# Altium schematic sheet bldc_motor_driver.SchDoc
size OrCAD C; PageSetup: Record=PageOptions|CenterHorizontal=True|CenterVertical=True|PrintScale=0.96|XCorrection=1.00|YCorrection=1.00|PrintKind=2|BorderSize=5000000|LeftOffset=0|BottomOffset=0|Orientation=2|PaperLength=4318|PaperWidth=2794|Scale=100|PaperSource=15|PrintQuality=600|MediaType=1|DitherType=10|PaperKind=11x17|PrintScaleMode=1
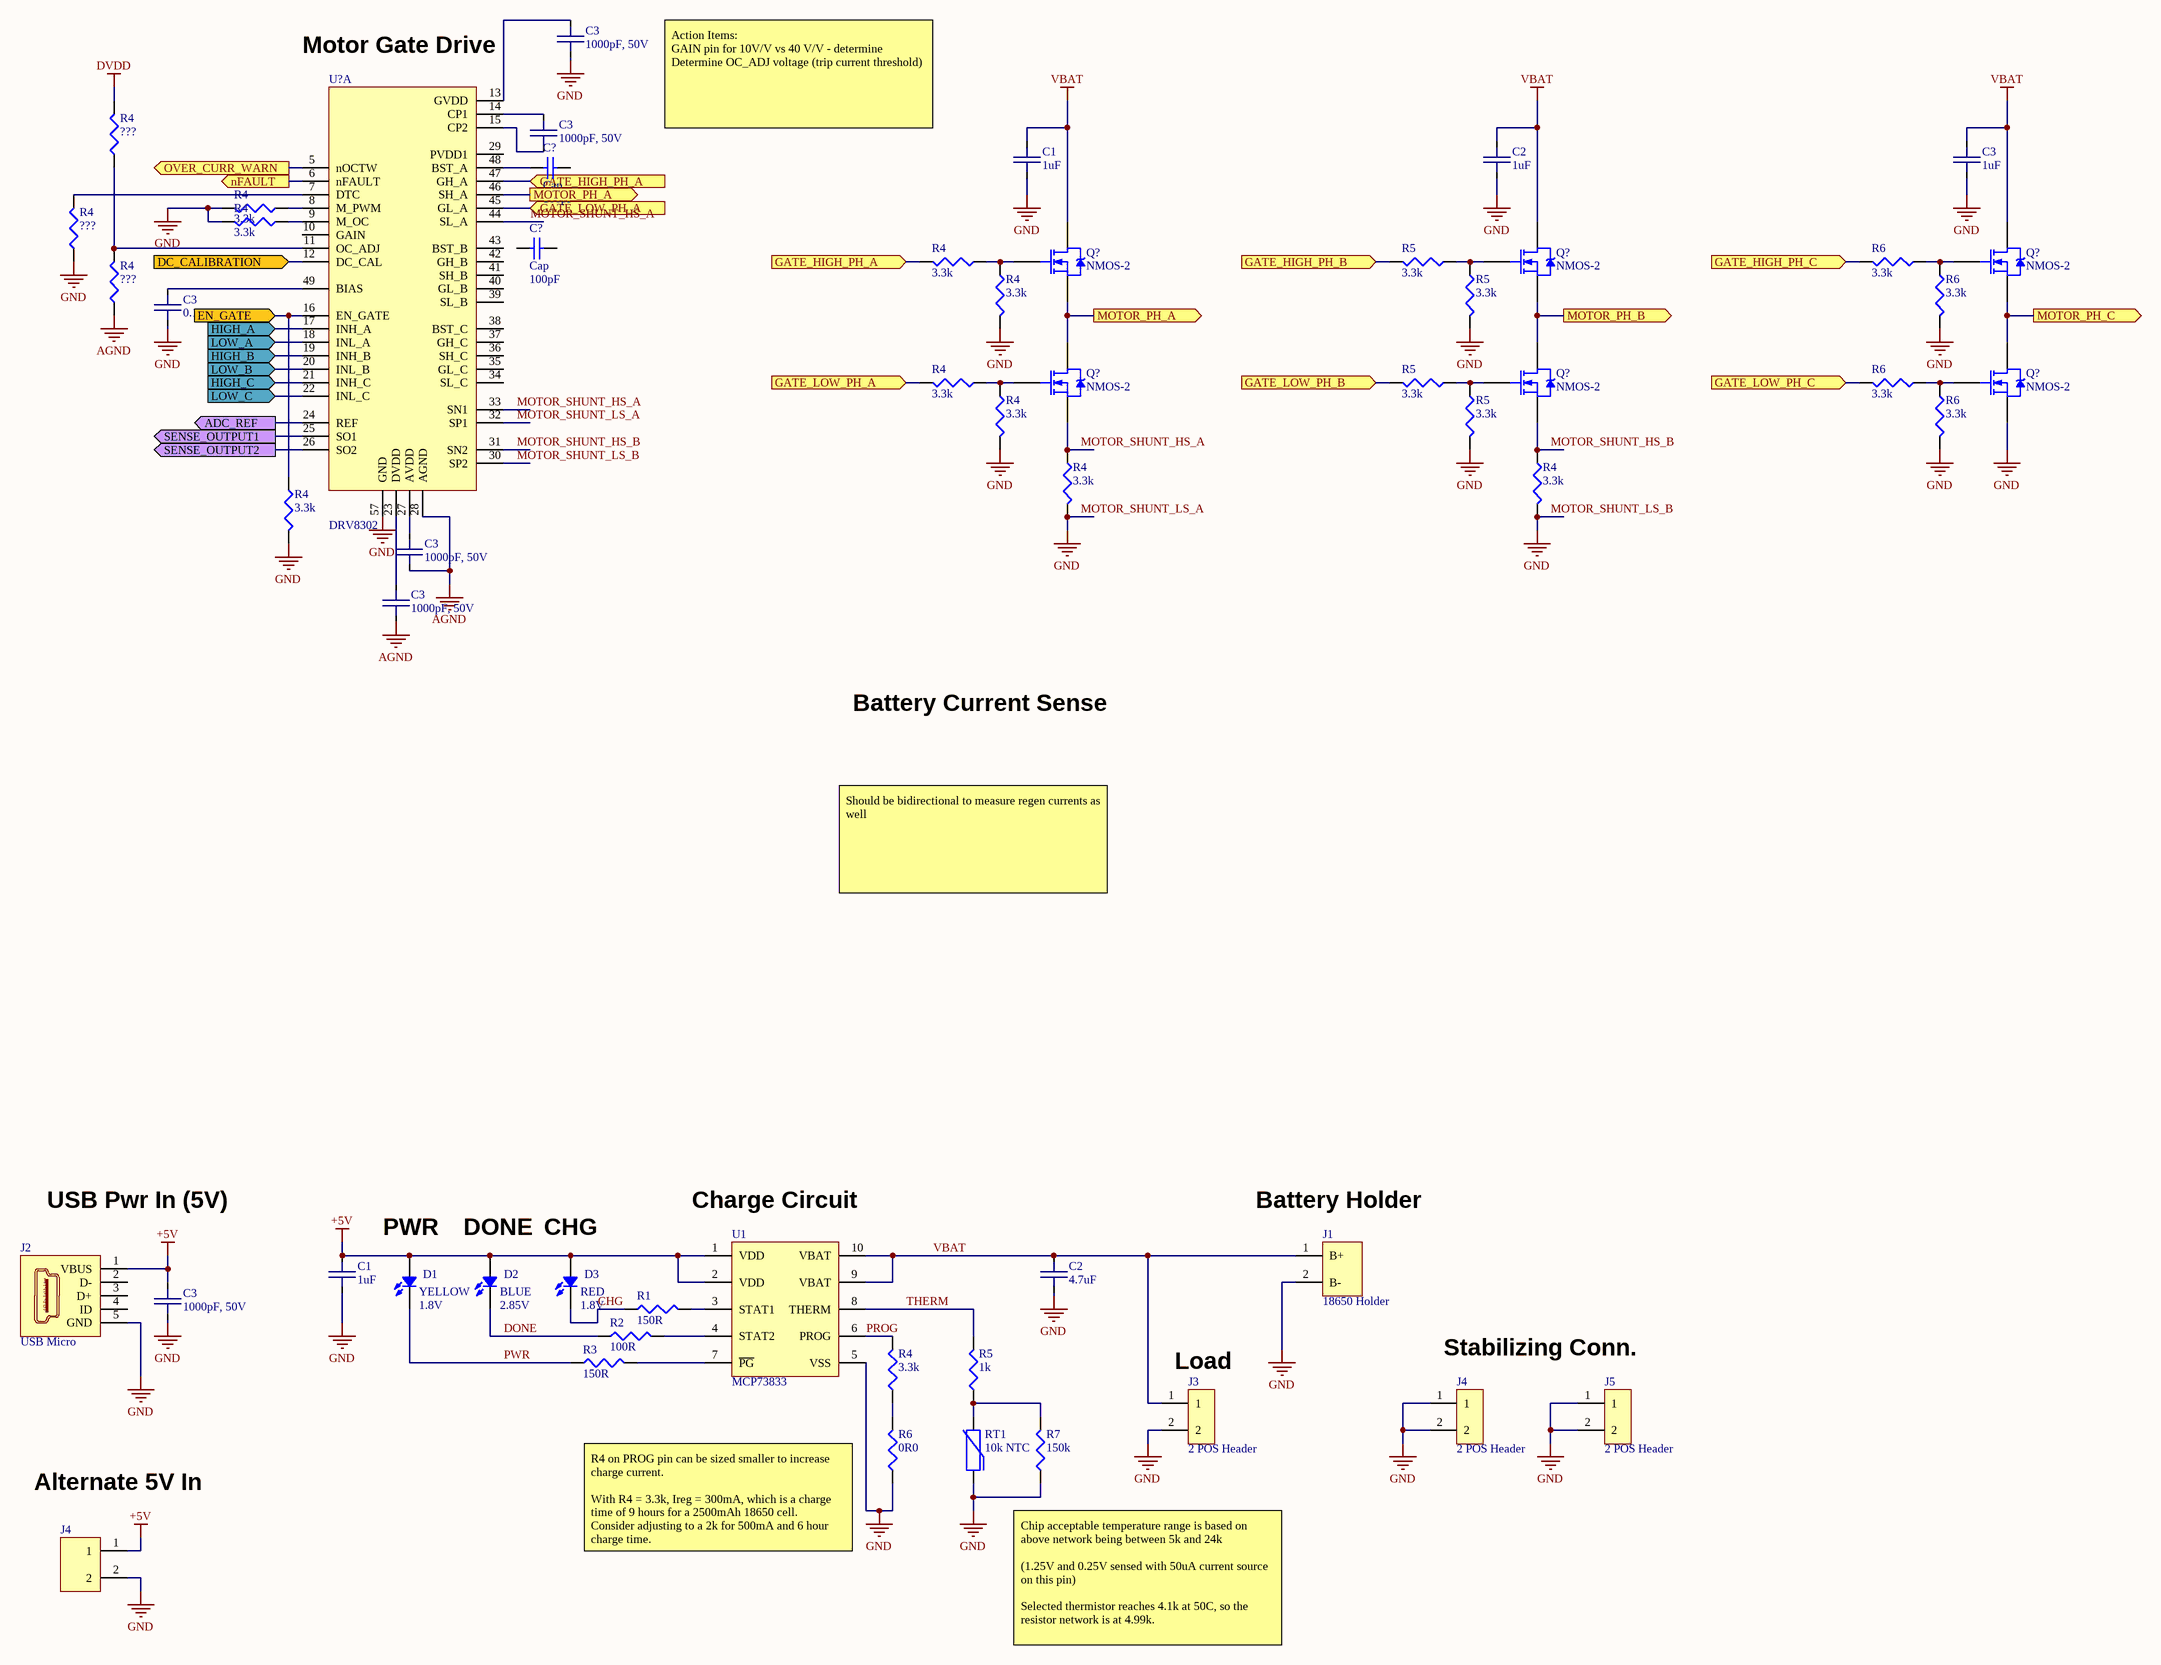
[diagram p0: bldc_motor_driver.SchDoc]

## Parts
(Parts that share a designator on the sheet are numbered #1, #2 ... from top to bottom, then left to right.)
C1#1  1uF  [0603_CAP]
C1#2  1uF  [0603_CAP]
C2#1  1uF  [0603_CAP]
C2#2  4.7uF  [0603_CAP]
C3#1  1000pF, 50V  [0603_CAP]
C3#2  1000pF, 50V  [0603_CAP]
C3#3  1uF  [0603_CAP]
C3#4  0.1uF  [0603_CAP]
C3#5  1000pF, 50V  [0603_CAP]
C3#6  1000pF, 50V  [0603_CAP]
C3#7  1000pF, 50V  [0603_CAP]
C?#1  Cap  value 100pF  [RAD-0.3]
C?#2  Cap  value 100pF  [RAD-0.3]
D1  LY L29K-H1K2-26-Z  [LED_Y]  (value not drawn)
D2  LED BLUE, 2.85V  [LED_BLUE]  (value not drawn)
D3  LH R974-LP-1  [LED_RED]  (value not drawn)
J1  18650 Holder  [18650_holder]
J2  USB Micro  [USB Micro SMD]
J3  2 POS Header  [2 POS Header]
J4#1  2 POS Header  [2 POS Header]
J4#2  alternate_pad_conn  [alternate_conn_pads]  (value not drawn)
J5  2 POS Header  [2 POS Header]
Q?#1  NMOS-2  [TO-220AB]
Q?#2  NMOS-2  [TO-220AB]
Q?#3  NMOS-2  [TO-220AB]
Q?#4  NMOS-2  [TO-220AB]
Q?#5  NMOS-2  [TO-220AB]
Q?#6  NMOS-2  [TO-220AB]
R1  150R  [0603_CAP]
R2  100R  [0603_CAP]
R3  150R  [0603_CAP]
R4#1  ???  [0603_CAP]
R4#2  3.3k  [0603_CAP]
R4#3  3.3k  [0603_CAP]
R4#4  ???  [0603_CAP]
R4#5  3.3k  [0603_CAP]
R4#6  3.3k  [0603_CAP]
R4#7  ???  [0603_CAP]
R4#8  3.3k  [0603_CAP]
R4#9  3.3k  [0603_CAP]
R4#10  3.3k  [0603_CAP]
R4#11  3.3k  [0603_CAP]
R4#12  3.3k  [0603_CAP]
R4#13  3.3k  [0603_CAP]
R5#1  3.3k  [0603_CAP]
R5#2  3.3k  [0603_CAP]
R5#3  3.3k  [0603_CAP]
R5#4  3.3k  [0603_CAP]
R5#5  1k  [0603_CAP]
R6#1  3.3k  [0603_CAP]
R6#2  3.3k  [0603_CAP]
R6#3  3.3k  [0603_CAP]
R6#4  3.3k  [0603_CAP]
R6#5  0R0  [0603_CAP]
R7  150k  [0603_CAP]
RT1  10k NTC  [0603_CAP]
U1  MCP73833  [MSOP-10]
U?  DRV8302  (part A of 2)

## Ports
ADC_REF (out), DC_CALIBRATION (in), EN_GATE (in), GATE_HIGH_PH_A (in), GATE_HIGH_PH_B (in), GATE_HIGH_PH_C (in), GATE_LOW_PH_A (in), GATE_LOW_PH_B (in), GATE_LOW_PH_C (in), HIGH_A (in), HIGH_B (in), HIGH_C (in), LOW_A (in), LOW_B (in), LOW_C (in), MOTOR_PH_A (out), MOTOR_PH_B (out), MOTOR_PH_C (out), nFAULT (out), OVER_CURR_WARN (out), SENSE_OUTPUT1 (out), SENSE_OUTPUT2 (out)

## Nets
+5V: C1#2.2 C3#7.1 D1.A D2.2 D3.2 J2.1(VBUS) J4#2.1 U1.1(VDD) U1.2(VDD)
AGND: C3#5.2 C3#6.2 R4#7.1 U?.28(AGND)
DVDD: R4#1.2
MOTOR_SHUNT_LS_A: C1#1.1 C1#2.1 C2#1.1 C2#2.1 C3#1.1 C3#3.1 C3#4.2 C3#7.2 J1.2(B-) J2.5(GND) J3.2 J4#1.1 J4#1.2 J4#2.2 J5.1 J5.2 Q?#6.3(S) R4#2.2 R4#3.2 R4#4.1 R4#6.2 R4#9.2 R4#10.2 R4#11.2 R4#12.2 R5#2.2 R5#4.2 R6#2.2 R6#4.2 R6#5.1 R7.1 RT1.1 U1.5(VSS) U?.30(SP2) U?.32(SP1) U?.57(GND)  [also labelled GND, MOTOR_SHUNT_LS_B]
VBAT: C1#1.2 C2#1.2 C2#2.2 C3#3.2 J1.1(B+) J3.1 Q?#1.2(D) Q?#2.2(D) Q?#3.2(D) U1.9(VBAT) U1.10(VBAT)
ADC_REF: U?.24(REF) ; port ADC_REF
CHG: D3.1 R1.1
DC_CALIBRATION: U?.12(DC_CAL) ; port DC_CALIBRATION
DONE: D2.1 R2.1
EN_GATE: R4#12.1 U?.16(EN_GATE) ; port EN_GATE
GATE_HIGH_PH_A: R4#5.2 U?.47(GH_A) ; port GATE_HIGH_PH_A
GATE_HIGH_PH_B: R5#1.2 ; port GATE_HIGH_PH_B
GATE_HIGH_PH_C: R6#1.2 ; port GATE_HIGH_PH_C
GATE_LOW_PH_A: R4#8.2 U?.45(GL_A) ; port GATE_LOW_PH_A
GATE_LOW_PH_B: R5#3.2 ; port GATE_LOW_PH_B
GATE_LOW_PH_C: R6#3.2 ; port GATE_LOW_PH_C
HIGH_A: U?.17(INH_A) ; port HIGH_A
HIGH_B: U?.19(INH_B) ; port HIGH_B
HIGH_C: U?.21(INH_C) ; port HIGH_C
LOW_A: U?.18(INL_A) ; port LOW_A
LOW_B: U?.20(INL_B) ; port LOW_B
LOW_C: U?.22(INL_C) ; port LOW_C
MOTOR_PH_A: Q?#1.3(S) Q?#4.2(D) U?.46(SH_A) ; port MOTOR_PH_A
MOTOR_PH_B: Q?#2.3(S) Q?#5.2(D) ; port MOTOR_PH_B
MOTOR_PH_C: Q?#3.3(S) Q?#6.2(D) ; port MOTOR_PH_C
MOTOR_SHUNT_HS_A: Q?#4.3(S) R4#10.1 U?.33(SN1) U?.44(SL_A)
MOTOR_SHUNT_HS_B: Q?#5.3(S) R4#11.1 U?.31(SN2)
nFAULT: U?.6(nFAULT) ; port nFAULT
OVER_CURR_WARN: U?.5(nOCTW) ; port OVER_CURR_WARN
PROG: R4#13.2 U1.6(PROG)
PWR: D1.K R3.1
SENSE_OUTPUT1: U?.25(SO1) ; port SENSE_OUTPUT1
SENSE_OUTPUT2: U?.26(SO2) ; port SENSE_OUTPUT2
THERM: R5#5.2 U1.8(THERM)
NetC3#1_2: C3#1.2 U?.13(GVDD)
NetC3#2_1: C3#2.1 U?.15(CP2)
NetC3#2_2: C3#2.2 U?.14(CP1)
NetC3#4_1: C3#4.1 U?.49(BIAS)
NetC3#5_1: C3#5.1 U?.27(AVDD)
NetC3#6_1: C3#6.1 U?.23(DVDD)
NetC?#1_1: C?#1.1 U?.48(BST_A)
NetQ?#1_1: Q?#1.1(G) R4#5.1 R4#6.1
NetQ?#2_1: Q?#2.1(G) R5#1.1 R5#2.1
NetQ?#3_1: Q?#3.1(G) R6#1.1 R6#2.1
NetQ?#4_1: Q?#4.1(G) R4#8.1 R4#9.1
NetQ?#5_1: Q?#5.1(G) R5#3.1 R5#4.1
NetQ?#6_1: Q?#6.1(G) R6#3.1 R6#4.1
NetR1_2: R1.2 U1.3(STAT1)
NetR2_2: R2.2 U1.4(STAT2)
NetR3_2: R3.2 U1.7(~{PG})
NetR4#1_1: R4#1.1 R4#7.2 U?.11(OC_ADJ)
NetR4#2_1: R4#2.1 U?.8(M_PWM)
NetR4#3_1: R4#3.1 U?.9(M_OC)
NetR4#4_2: R4#4.2 U?.7(DTC)
NetR4#13_1: R4#13.1 R6#5.2
NetR5#5_1: R5#5.1 R7.2 RT1.2

Not connected (* = marked no-connect by the designer): C?#1 2; C?#2 1 2; J2 2(D-) 3(D+) 4(ID); U? 10(GAIN) 29(PVDD1) 34(SL_C) 35(GL_C) 36(SH_C) 37(GH_C) 38(BST_C) 39(SL_B) 40(GL_B) 41(SH_B) 42(GH_B) 43(BST_B)

## Notes on the sheet
- (near U?) Motor Gate Drive
- Action Items:
  GAIN pin for 10V/V vs 40 V/V - determine
  Determine OC_ADJ voltage (trip current threshold)
- Battery Current Sense
- Should be bidirectional to measure regen currents as well
- USB Pwr In (5V)
- (near U1) Charge Circuit
- (near J1) Battery Holder
- PWR
- (near D2) DONE
- (near D3) CHG
- Stabilizing Conn.
- (near J3) Load
- Alternate 5V In
- (near R6#5) R4 on PROG pin can be sized smaller to increase charge current.
  With R4 = 3.3k, Ireg = 300mA, which is a charge time of 9 hours for a 2500mAh 18650 cell.
  Consider adjusting to a 2k for 500mA and 6 hour charge time.
- Chip acceptable temperature range is based on above network being between 5k and 24k
  (1.25V and 0.25V sensed with 50uA current source on this pin)
  Selected thermistor reaches 4.1k at 50C, so the resistor network is at 4.99k.
- Title
- Size:
- Date:
- File:
- Orcad C
- Number:
- Time:
- Revision:
- Sheet
- of
- (in symbol LB Q39G-L2OO-35-1) BLUE
- (in symbol LH R974-LP-1) RED
- (in symbol LY L29K-H1K2-26-Z) YELLOW

## Library data of the parts
C1#1 C1#2 C2#1 C3#3 = CL10A105KA8NNNC: CAP CER 1UF 25V X5R 0603; Manufacturer 1: Samsung Electro-Mechanics America, Inc.; Category 1: Capacitors; Capacitance: 1µF; Tolerance: ±10%; Supplier 1: Digi-Key; Manufacturer Part Number 1: CL10A105KA8NNNC; RoHS: RoHS Compliant; Description 1: CAP CER 1UF 25V X5R 0603; Stock 1: 493139; Pricing 1: 1=0.1, 10=0.03, 25=0.022, 50=0.0164, 100=0.0134, 250=0.01124, 500=0.0096, 1000=0.00754 (USD); Packaging: Cut Tape (CT); Voltage - Rated: 25V; Temperature Coefficient: X5R; Mounting Type: Surface Mount, MLCC; Operating Temperature: -55°C ~ 85°C; Applications: General Purpose; Ratings: -; Package / Case: 0603 (1608 Metric); Size / Dimension: 0.063" L x 0.031" W (1.60mm x 0.80mm); Height - Seated (Max): -; Thickness (Max): 0.035" (0.90mm); Lead Spacing: -; Features: -; Lead Style: -; ComponentLink1URL: http://www.samsungsem.com/kr/support/product-search/mlcc/__icsFiles/afieldfile/2015/08/14/S_CL10A105KA8NNNC.pdf; ComponentLink1Description: http://www.samsungsem.com/kr/support/product-search/mlcc/__icsFiles/afieldfile/2015/08/14/S_CL10A105KA8NNNC.pdf; Supplier Part Number 1: 1276-1102-1-ND
C2#2 = CL10A475KO8NNNC: CAP CER 4.7UF 16V X5R 0603; Manufacturer 1: Samsung Electro-Mechanics America, Inc.; Category 1: Capacitors; Capacitance: 4.7µF; Tolerance: ±10%; Supplier 1: Digi-Key; Manufacturer Part Number 1: CL10A475KO8NNNC; RoHS: RoHS Compliant; Description 1: CAP CER 4.7UF 16V X5R 0603; Stock 1: 144593; Pricing 1: 1=0.26, 10=0.216, 25=0.1484, 50=0.1216, 100=0.108, 500=0.07156, 1000=0.06345 (USD); Packaging: Cut Tape (CT); Voltage - Rated: 16V; Temperature Coefficient: X5R; Mounting Type: Surface Mount, MLCC; Operating Temperature: -55°C ~ 85°C; Applications: General Purpose; Ratings: -; Package / Case: 0603 (1608 Metric); Size / Dimension: 0.063" L x 0.031" W (1.60mm x 0.80mm); Height - Seated (Max): -; Thickness (Max): 0.035" (0.90mm); Lead Spacing: -; Features: -; Lead Style: -; ComponentLink1URL: http://www.samsungsem.com/kr/support/product-search/mlcc/__icsFiles/afieldfile/2015/08/14/S_CL10A475KO8NNNC.pdf; ComponentLink1Description: http://www.samsungsem.com/kr/support/product-search/mlcc/__icsFiles/afieldfile/2015/08/14/S_CL10A475KO8NNNC.pdf; Supplier Part Number 1: 1276-1784-1-ND
C3#1 C3#2 C3#4-C3#7 = GRM188R71H102KA01D: CAP CER 1000PF 50V X7R 0603; Manufacturer 1: Murata Electronics North America; Category 1: Capacitors; Tolerance: ±10%; Supplier 1: Digi-Key; Manufacturer Part Number 1: GRM188R71H102KA01D; RoHS: RoHS Compliant; Description 1: CAP CER 1000PF 50V X7R 0603; Stock 1: 1085899; Pricing 1: 1=0.1, 10=0.02, 50=0.0108, 100=0.0091, 250=0.00744, 500=0.00636, 1000=0.00495 (USD); Packaging: Cut Tape (CT); Capacitance: 1000pF; Voltage - Rated: 50V; Temperature Coefficient: X7R; Mounting Type: Surface Mount, MLCC; Operating Temperature: -55°C ~ 125°C; Applications: General Purpose; Ratings: -; Package / Case: 0603 (1608 Metric); Size / Dimension: 0.063" L x 0.031" W (1.60mm x 0.80mm); Height - Seated (Max): -; Thickness (Max): 0.035" (0.90mm); Lead Spacing: -; Features: -; Lead Style: -; ComponentLink1URL: http://www.murata.com/~/media/webrenewal/support/library/catalog/products/capacitor/mlcc/c02e.pdf; ComponentLink1Description: http://www.murata.com/~/media/webrenewal/support/library/catalog/products/capacitor/mlcc/c02e.pdf; Supplier Part Number 1: 490-1494-1-ND
C?#1 C?#2 = Cap: Capacitor; Published: 8-Jun-2000; LatestRevisionDate: 17-Jul-2002; LatestRevisionNote: Re-released for DXP Platform.; PackageReference: RAD-0.3; Publisher: Altium Limited; PackageDescription: Radial Cap, Thru-Hole; 2 Leads; 0.3 in Pin Spacing
D1 = LY L29K-H1K2-26-Z: LED YELLOW DIFFUSED 0603 SMD; Manufacturer 1: OSRAM Opto Semiconductors Inc.; Category 1: Optoelectronics; Wavelength - Dominant: 587nm; Wavelength - Peak: 591nm; Millicandela Rating: 7mcd; Voltage - Forward (Vf) (Typ): 1.8V; Current - Test: 2mA; Viewing Angle: 160°; Lens Color: White; Lens Style/Size: Rectangle with Flat Top, 1.30mm x 0.80mm; Supplier 1: Digi-Key; Manufacturer Part Number 1: LY L29K-H1K2-26-Z; RoHS: RoHS Compliant; Description 1: LED YELLOW DIFFUSED 0603 SMD; Stock 1: 36397; Pricing 1: 1=0.38, 10=0.266, 25=0.2184, 100=0.1746, 250=0.13092, 500=0.11902, 1000=0.09522, 2500=0.07737 (USD); Packaging: Cut Tape (CT); Color: Yellow; Lens Transparency: Diffused; Package / Case: 0603 (1608 Metric); Supplier Device Package: *; Size / Dimension: 1.70mm L x 0.80mm W; Height (Max): 0.65mm; Mounting Type: Surface Mount; ComponentLink1URL: http://www.osram-os.com/Graphics/XPic1/00077106_0.pdf; ComponentLink1Description: http://www.osram-os.com/Graphics/XPic1/00077106_0.pdf; Supplier Part Number 1: 475-1196-1-ND
D2 = LB Q39G-L2OO-35-1: LED BLUE DIFFUSED 0603 SMD; Manufacturer 1: OSRAM Opto Semiconductors Inc.; Category 1: Optoelectronics; Lens Color: White; Millicandela Rating: 29.5mcd; Lens Style/Size: Rectangle with Flat Top, 1.10mm x 0.80mm; Current - Test: 5mA; Viewing Angle: 155°, 135°; Wavelength - Dominant: 470nm; Wavelength - Peak: 472nm; Supplier 1: Digi-Key; Manufacturer Part Number 1: LB Q39G-L2OO-35-1; RoHS: RoHS Compliant; Description 1: LED BLUE DIFFUSED 0603 SMD; Stock 1: 40853; Pricing 1: 1=0.38, 10=0.266, 25=0.2184, 100=0.1746, 250=0.13092, 500=0.11902, 1000=0.09522 (USD); Packaging: Cut Tape (CT); Color: Blue; Lens Transparency: Diffused; Voltage - Forward (Vf) (Typ): 2.85V; Mounting Type: Surface Mount; Features: -; Package / Case: 0603 (1608 Metric); Supplier Device Package: *; Size / Dimension: 1.60mm L x 0.80mm W; Height (Max): 0.40mm; ComponentLink1URL: http://media.digikey.com/pdf/Data%20Sheets/Osram%20PDFs/LB_LT%20Q39G.pdf; ComponentLink1Description: http://media.digikey.com/pdf/Data%20Sheets/Osram%20PDFs/LB_LT%20Q39G.pdf; Supplier Part Number 1: 475-2816-1-ND
D3 = LH R974-LP-1: LED RED DIFFUSED 0805 SMD; Manufacturer 1: OSRAM Opto Semiconductors Inc.; Category 1: Optoelectronics; Lens Color: White; Millicandela Rating: 41mcd; Lens Style/Size: Rectangle with Flat Top, 1.30mm x 1.25mm; Voltage - Forward (Vf) (Typ): 1.8V; Current - Test: 20mA; Viewing Angle: 160°; Wavelength - Dominant: 645nm; Wavelength - Peak: 660nm; Supplier 1: Digi-Key; Manufacturer Part Number 1: LH R974-LP-1; RoHS: RoHS Compliant; Description 1: LED RED DIFFUSED 0805 SMD; Stock 1: 48323; Pricing 1: 1=0.26, 10=0.207, 25=0.1792, 100=0.1131, 250=0.0754, 500=0.06408, 1000=0.049 (USD); Packaging: Cut Tape (CT); Color: Red; Lens Transparency: Diffused; Mounting Type: Surface Mount; Features: -; Package / Case: 0805 (2012 Metric); Supplier Device Package: *; Size / Dimension: 2.00mm L x 1.25mm W; Height (Max): 0.90mm; ComponentLink1URL: http://www.osram-os.com/Graphics/XPic8/00078869_0.pdf; ComponentLink1Description: http://www.osram-os.com/Graphics/XPic8/00078869_0.pdf; Supplier Part Number 1: 475-1415-1-ND
J1 = 1042: HOLDER BATTERY 1CELL 18650 SMD; Manufacturer 1: Keystone Electronics; Category 1: Battery Products; Battery Type, Function: Cylindrical, Holder; Style: Holder (Open); Battery Cell Size: 18650; Number of Cells: 1; Supplier 1: Digi-Key; Manufacturer Part Number 1: 1042; RoHS: RoHS Compliant; Description 1: HOLDER BATTERY 1CELL 18650 SMD; Stock 1: 1754; Pricing 1: 1=2.47, 10=2.107, 50=1.892, 100=1.806, 250=1.634, 500=1.505, 1000=1.29, 2500=1.204, 5000=1.153 (USD); Battery Series: -; Mounting Type: PCB, Surface Mount; Termination Style: SMD (SMT) Tab; Height Above Board: 0.585" (14.86mm); Operating Temperature: -50°C ~ 145°C; ComponentLink1URL: http://www.keyelco.com/product-pdf.cfm?p=918; ComponentLink1Description: http://www.keyelco.com/product-pdf.cfm?p=918; Supplier Part Number 1: 36-1042-ND
J2 = 10118192-0001LF: CONN USB MICRO B RECPT SMT R/A; Manufacturer 1: Amphenol FCI; Category 1: Connectors, Interconnects; Connector Type: USB - micro B; Number of Contacts: 5; Gender: Receptacle; Specifications: USB 2.0; Supplier 1: Digi-Key; Manufacturer Part Number 1: 10118192-0001LF; RoHS: RoHS Compliant; Description 1: CONN USB MICRO B RECPT SMT R/A; Stock 1: 151566; Pricing 1: 1=0.46, 10=0.437, 25=0.3744, 50=0.318, 100=0.3056, 250=0.27444, 500=0.26196 (USD); Packaging: Digi-Reel®; Mounting Type: Surface Mount, Right Angle, Horizontal; Features: Flange, Shielded; Ingress Protection: -; ComponentLink1URL: http://portal.fciconnect.com/Comergent//fci/drawing/10118192.pdf; ComponentLink1Description: http://portal.fciconnect.com/Comergent//fci/drawing/10118192.pdf; Supplier Part Number 1: 609-4613-6-ND
J3 J4#1 J5 = 961102-6404-AR: CONN HEADER VERT SGL 2POS GOLD; Manufacturer 1: 3M; Category 1: Connectors, Interconnects; Connector Type: Header, Unshrouded; Number of Positions: 2; Number of Positions Loaded: All; Pitch: 0.100" (2.54mm); Supplier 1: Digi-Key; Manufacturer Part Number 1: 961102-6404-AR; RoHS: RoHS Compliant; Description 1: CONN HEADER VERT SGL 2POS GOLD; Stock 1: 150778; Pricing 1: 1=0.16, 10=0.15, 25=0.128, 50=0.112, 100=0.104, 250=0.092, 500=0.088, 1000=0.072, 2500=0.066 (USD); Packaging: Bulk; Part Status: Active; Contact Type: Male Pin; Number of Rows: 1; Row Spacing: -; Contact Mating Length: 0.217" (5.50mm); Mounting Type: Through Hole; Termination: Solder; Fastening Type: -; Features: -; Contact Finish: Gold; Contact Finish Thickness: Flash; Color: Black; ComponentLink1URL: http://multimedia.3m.com/mws/media/548112O/3mtm-pin-strip-header-ts2181.pdf; ComponentLink1Description: http://multimedia.3m.com/mws/media/548112O/3mtm-pin-strip-header-ts2181.pdf; Supplier Part Number 1: 3M9447-ND
Q?#1-Q?#6 = NMOS-2: N-Channel Power MOSFET; Note: Pin 2 is electrically connected to pin 4.; Published: 8-Jun-2000; LatestRevisionDate: 17-Jul-2002; LatestRevisionNote: Re-released for DXP Platform.; DatasheetVersion: PD-9.814; PackageVersion: Feb-1997; PackageReference: TO-220AB; Publisher: Altium Limited; PackageDescription: TO, Thru-Hole, Vertical, Heatsink Mounted; 3 In-Line Leads; Pitch 2.54 mm; ComponentLink1Description: Manufacturer Link; ComponentLink1URL: http://www.irf.com/
R1 R3 = RC0603JR-07150RL: RES SMD 150 OHM 5% 1/10W 0603; Manufacturer 1: Yageo; Category 1: Resistors; Resistance (Ohms): 150; Power (Watts): 0.1W, 1/10W; Temperature Coefficient: ±100ppm/°C; Supplier 1: Digi-Key; Manufacturer Part Number 1: RC0603JR-07150RL; RoHS: RoHS Compliant; Description 1: RES SMD 150 OHM 5% 1/10W 0603; Stock 1: 512312; Pricing 1: 1=0.1, 10=0.011, 25=0.008, 100=0.0044, 250=0.00336, 500=0.0027, 1000=0.00198, 2500=0.00172 (USD); Packaging: Cut Tape (CT); Tolerance: ±5%; Composition: Thick Film; Features: Moisture Resistant; Operating Temperature: -55°C ~ 155°C; Package / Case: 0603 (1608 Metric); Supplier Device Package: 0603; Size / Dimension: 0.063" L x 0.031" W (1.60mm x 0.80mm); Height: 0.022" (0.55mm); Number of Terminations: 2; ComponentLink1URL: http://www.yageo.com/documents/recent/PYu-RC_Group_51_RoHS_L_04.pdf; ComponentLink1Description: http://www.yageo.com/documents/recent/PYu-RC_Group_51_RoHS_L_04.pdf; Supplier Part Number 1: 311-150GRCT-ND
R2 = RC0603FR-07100RL: RES SMD 100 OHM 1% 1/10W 0603; Manufacturer 1: Yageo; Category 1: Resistors; Resistance (Ohms): 100; Power (Watts): 0.1W, 1/10W; Temperature Coefficient: ±100ppm/°C; Supplier 1: Digi-Key; Manufacturer Part Number 1: RC0603FR-07100RL; RoHS: RoHS Compliant; Description 1: RES SMD 100 OHM 1% 1/10W 0603; Stock 1: 2430445; Pricing 1: 1=0.1, 10=0.014, 25=0.01, 100=0.0057, 250=0.00436, 500=0.00348, 1000=0.00257, 2500=0.00223 (USD); Packaging: Cut Tape (CT); Tolerance: ±1%; Composition: Thick Film; Features: Moisture Resistant; Operating Temperature: -55°C ~ 155°C; Package / Case: 0603 (1608 Metric); Supplier Device Package: 0603; Size / Dimension: 0.063" L x 0.031" W (1.60mm x 0.80mm); Height: 0.022" (0.55mm); Number of Terminations: 2; ComponentLink1URL: http://www.yageo.com/documents/recent/PYu-RC_Group_51_RoHS_L_04.pdf; ComponentLink1Description: http://www.yageo.com/documents/recent/PYu-RC_Group_51_RoHS_L_04.pdf; Supplier Part Number 1: 311-100HRCT-ND
R4#1-R4#13 R5#1-R5#4 R6#1-R6#4 = RC0603FR-073K3L: RES SMD 3.3K OHM 1% 1/10W 0603; Manufacturer 1: Yageo; Category 1: Resistors; Power (Watts): 0.1W, 1/10W; Temperature Coefficient: ±100ppm/°C; Supplier 1: Digi-Key; Manufacturer Part Number 1: RC0603FR-073K3L; RoHS: RoHS Compliant; Description 1: RES SMD 3.3K OHM 1% 1/10W 0603; Stock 1: 668905; Pricing 1: 1=0.1, 10=0.014, 25=0.01, 100=0.0057, 250=0.00436, 500=0.00348, 1000=0.00257, 2500=0.00223 (USD); Packaging: Cut Tape (CT); Resistance (Ohms): 3.3k; Tolerance: ±1%; Composition: Thick Film; Features: Moisture Resistant; Operating Temperature: -55°C ~ 155°C; Package / Case: 0603 (1608 Metric); Supplier Device Package: 0603; Size / Dimension: 0.063" L x 0.031" W (1.60mm x 0.80mm); Height: 0.022" (0.55mm); Number of Terminations: 2; ComponentLink1URL: http://www.yageo.com/documents/recent/PYu-RC_Group_51_RoHS_L_04.pdf; ComponentLink1Description: http://www.yageo.com/documents/recent/PYu-RC_Group_51_RoHS_L_04.pdf; Supplier Part Number 1: 311-3.30KHRCT-ND
R5#5 = RC0603FR-071KL: RES SMD 1K OHM 1% 1/10W 0603; Manufacturer 1: Yageo; Category 1: Resistors; Power (Watts): 0.1W, 1/10W; Temperature Coefficient: ±100ppm/°C; Supplier 1: Digi-Key; Manufacturer Part Number 1: RC0603FR-071KL; RoHS: RoHS Compliant; Description 1: RES SMD 1K OHM 1% 1/10W 0603; Stock 1: 4519743; Pricing 1: 1=0.1, 10=0.014, 25=0.01, 100=0.0057, 250=0.00436, 500=0.00348, 1000=0.00257, 2500=0.00223 (USD); Packaging: Cut Tape (CT); Resistance (Ohms): 1k; Tolerance: ±1%; Composition: Thick Film; Features: Moisture Resistant; Operating Temperature: -55°C ~ 155°C; Package / Case: 0603 (1608 Metric); Supplier Device Package: 0603; Size / Dimension: 0.063" L x 0.031" W (1.60mm x 0.80mm); Height: 0.022" (0.55mm); Number of Terminations: 2; ComponentLink1URL: http://www.yageo.com/documents/recent/PYu-RC_Group_51_RoHS_L_04.pdf; ComponentLink1Description: http://www.yageo.com/documents/recent/PYu-RC_Group_51_RoHS_L_04.pdf; Supplier Part Number 1: 311-1.00KHRCT-ND
R6#5 = RC0603JR-070RL: RES SMD 0.0OHM JUMPER 1/10W 0603; Manufacturer 1: Yageo; Category 1: Resistors; Resistance (Ohms): 0.0; Power (Watts): 0.1W, 1/10W; Supplier 1: Digi-Key; Manufacturer Part Number 1: RC0603JR-070RL; RoHS: RoHS Compliant; Description 1: RES SMD 0.0OHM JUMPER 1/10W 0603; Stock 1: 6230896; Pricing 1: 1=0.1, 10=0.011, 25=0.008, 100=0.0045, 250=0.00348, 500=0.00278, 1000=0.00204, 2500=0.00177 (USD); Packaging: Cut Tape (CT); Tolerance: Jumper; Composition: Thick Film; Features: Moisture Resistant; Temperature Coefficient: -; Operating Temperature: -55°C ~ 155°C; Package / Case: 0603 (1608 Metric); Supplier Device Package: 0603; Size / Dimension: 0.063" L x 0.031" W (1.60mm x 0.80mm); Height: 0.022" (0.55mm); Number of Terminations: 2; ComponentLink1URL: http://www.yageo.com/documents/recent/PYu-RC_Group_51_RoHS_L_04.pdf; ComponentLink1Description: http://www.yageo.com/documents/recent/PYu-RC_Group_51_RoHS_L_04.pdf; Supplier Part Number 1: 311-0.0GRCT-ND
R7 = RC0603FR-07150KL: RES SMD 150K OHM 1% 1/10W 0603; Manufacturer 1: Yageo; Category 1: Resistors; Power (Watts): 0.1W, 1/10W; Temperature Coefficient: ±100ppm/°C; Supplier 1: Digi-Key; Manufacturer Part Number 1: RC0603FR-07150KL; RoHS: RoHS Compliant; Description 1: RES SMD 150K OHM 1% 1/10W 0603; Stock 1: 353498; Pricing 1: 1=0.1, 10=0.014, 25=0.01, 100=0.0057, 250=0.00436, 500=0.00348, 1000=0.00257, 2500=0.00223 (USD); Packaging: Cut Tape (CT); Resistance (Ohms): 150k; Tolerance: ±1%; Composition: Thick Film; Features: Moisture Resistant; Operating Temperature: -55°C ~ 155°C; Package / Case: 0603 (1608 Metric); Supplier Device Package: 0603; Size / Dimension: 0.063" L x 0.031" W (1.60mm x 0.80mm); Height: 0.022" (0.55mm); Number of Terminations: 2; ComponentLink1URL: http://www.yageo.com/documents/recent/PYu-RC_Group_51_RoHS_L_04.pdf; ComponentLink1Description: http://www.yageo.com/documents/recent/PYu-RC_Group_51_RoHS_L_04.pdf; Supplier Part Number 1: 311-150KHRCT-ND
RT1 = NCP18XH103J03RB: THERMISTOR 10K OHM NTC 0603 SMD; Manufacturer 1: Murata Electronics North America; Category 1: Sensors, Transducers; Resistance Tolerance: ±5%; B Value Tolerance: ±1%; B25/50: 3380K; B25/85: 3434K; B25/100: 3455K; Power - Max: 100mW; Supplier 1: Digi-Key; Manufacturer Part Number 1: NCP18XH103J03RB; RoHS: RoHS Compliant; Description 1: THERMISTOR 10K OHM NTC 0603 SMD; Stock 1: 94115; Pricing 1: 1=0.2, 10=0.169, 25=0.1556, 50=0.1244, 100=0.1067, 250=0.09776, 500=0.09332, 1000=0.07999 (USD); Packaging: Cut Tape (CT); Resistance in Ohms @ 25°C: 10k; B0/50: -; B25/75: -; Operating Temperature: -40°C ~ 125°C; Length - Lead Wire: -; Mounting Type: Surface Mount; Package / Case: 0603 (1608 Metric); ComponentLink1URL: http://www.murata.com/~/media/webrenewal/support/library/catalog/products/thermistor/ntc/r44e.ashx; ComponentLink1Description: http://www.murata.com/~/media/webrenewal/support/library/catalog/products/thermistor/ntc/r44e.ashx; Supplier Part Number 1: 490-2436-1-ND
U1 = MCP73833-AMI/UN: IC LI-ION/LI-POLY CTRLR 10MSOP; Manufacturer 1: Microchip Technology; Category 1: Integrated Circuits (ICs); Battery Chemistry: Lithium-Ion/Polymer; Number of Cells: 1; Current - Charging: Constant - Programmable; Programmable Features: Current; Fault Protection: Over Temperature; Charge Current - Max: 1.1A; Battery Pack Voltage: 4.2V; Voltage - Supply (Max): 6V; Supplier 1: Digi-Key; Manufacturer Part Number 1: MCP73833-AMI/UN; RoHS: RoHS Compliant; Description 1: IC LI-ION/LI-POLY CTRLR 10MSOP; Stock 1: 15750; Pricing 1: 1=0.85, 25=0.71, 100=0.65 (USD); Packaging: Tube; Interface: -; Operating Temperature: -40°C ~ 85°C (TA); Package / Case: 10-TFSOP, 10-MSOP (0.118", 3.00mm Width); Supplier Device Package: 10-MSOP; ComponentLink1URL: http://www.microchip.com/mymicrochip/filehandler.aspx?ddocname=en027983; ComponentLink1Description: http://www.microchip.com/mymicrochip/filehandler.aspx?ddocname=en027983; Supplier Part Number 1: MCP73833-AMI/UN-ND
U? = DRV8302DCAR: IC MOTOR CONTROLLER PAR 56HTSSOP; Manufacturer 1: Texas Instruments; Category 1: Integrated Circuits (ICs); Motor Type - AC, DC: Brushless DC (BLDC); Function: Controller - Commutation, Direction Management; Output Configuration: Pre-Driver - Half Bridge (3); Interface: Parallel; Voltage - Supply: 8 V ~ 60 V; Supplier 1: Digi-Key; Manufacturer Part Number 1: DRV8302DCAR; RoHS: RoHS Compliant; Description 1: IC MOTOR CONTROLLER PAR 56HTSSOP; Stock 1: 3089; Pricing 1: 1=6.14, 10=5.516, 100=4.5191, 500=3.84706, 1000=3.2445 (USD); Packaging: Cut Tape (CT); Part Status: Active; Motor Type - Stepper: -; Technology: Power MOSFET; Step Resolution: -; Applications: General Purpose; Current - Output: -; Voltage - Load: -; Operating Temperature: -40°C ~ 125°C (TA); Mounting Type: Surface Mount; Package / Case: 56-TFSOP (0.240", 6.10mm Width) Exposed Pad; Supplier Device Package: 56-HTSSOP; ComponentLink1URL: http://www.ti.com/lit/ds/symlink/drv8302.pdf; ComponentLink1Description: http://www.ti.com/lit/ds/symlink/drv8302.pdf; Supplier Part Number 1: 296-29544-1-ND